# Altium schematic sheet ESP_Grow_Main_Rev_B_1_CPU.SchDoc
size A
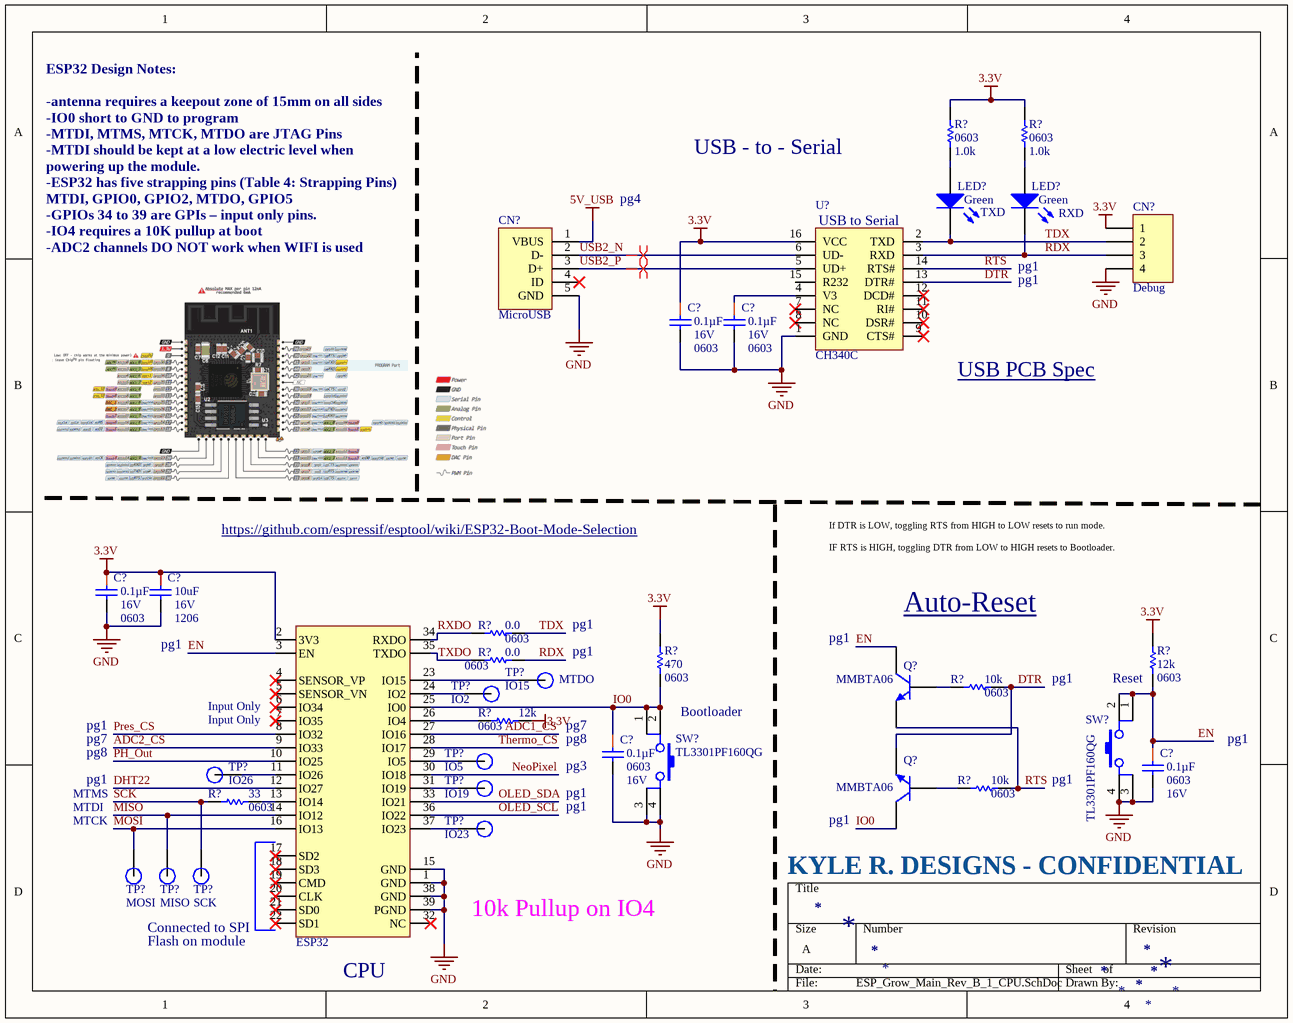
[diagram p0: ESP_Grow_Main_Rev_B_1_CPU.SchDoc]

## Parts
(Parts that share a designator on the sheet are numbered #1, #2 ... from top to bottom, then left to right.)
C?#1  Capacitance: 0.1µF  Package / Case: 0603  Voltage - Rated: 16V  [CAPC0603(1608)_L]  (hidden comment: 0.1uF)
C?#2  Capacitance: 0.1µF  Package / Case: 0603  Voltage - Rated: 16V  [CAPC0603(1608)_L]  (hidden comment: 0.1uF)
C?#3  Capacitance: 0.1µF  Package / Case: 0603  Voltage - Rated: 16V  [CAPC0603(1608)_L]  (hidden comment: 0.1uF)
C?#4  10uF  Voltage - Rated: 16V  Package: 1206  [CAPC1206(3216)_M]
C?#5  Capacitance: 0.1µF  Package / Case: 0603  Voltage - Rated: 16V  [CAPC0603(1608)_L]  (hidden comment: 0.1uF)
C?#6  Capacitance: 0.1µF  Package / Case: 0603  Voltage - Rated: 16V  [CAPC0603(1608)_L]  (hidden comment: 0.1uF)
CN?#1  Debug  [HDR1X4]
CN?#2  MicroUSB  [10118194-0001LF]
LED?#1  TXD  Color: Green  [SM-LED-0603]
LED?#2  RXD  Color: Green  [SM-LED-0603]
Q?#1  MMBTA06  [SOT23]
Q?#2  MMBTA06  [SOT23]
R?#1  Package / Case: 0603  [RESC0603(1608)_N]  (hidden comment: 1.0K)
R?#2  Package / Case: 0603  [RESC0603(1608)_N]  (hidden comment: 1.0K)
R?#3  Resistance (Ohms): 0.0  Package / Case: 0603  [RESC0603(1608)_N]  (hidden comment: 0)
R?#4  Resistance (Ohms): 0.0  Package / Case: 0603  [RESC0603(1608)_N]  (hidden comment: 0)
R?#5  Package / Case: 0603  [RESC0603(1608)_N]  (hidden comment: 470)
R?#6  Package / Case: 0603  [RESC0603(1608)_N]  (hidden comment: 12K)
R?#7  Resistance (Ohms): 10k  Package / Case: 0603  [RESC0603(1608)_L]  (hidden comment: 10K 1%)
R?#8  Package / Case: 0603  [RESC0603(1608)_N]  (hidden comment: 12K)
R?#9  Resistance (Ohms): 10k  Package / Case: 0603  [RESC0603(1608)_L]  (hidden comment: 10K 1%)
R?#10  Package / Case: 0603  [RESC0603(1608)_L]  (hidden comment: 33)
SW?#1  TL3301PF160QG  [TL3301PF160QG]
SW?#2  TL3301PF160QG  [TL3301PF160QG]
TP?#1  IO15  [TestPoint-Silk]  (no BOM)
TP?#2  IO2  [TestPoint-Silk]  (no BOM)
TP?#3  IO5  [TestPoint-Silk]  (no BOM)
TP?#4  IO26  [TestPoint-Silk]  (no BOM)
TP?#5  IO19  [TestPoint-Silk]  (no BOM)
TP?#6  IO23  [TestPoint-Silk]  (no BOM)
TP?#7  MOSI  [TestPoint-Silk]  (no BOM)
TP?#8  MISO  [TestPoint-Silk]  (no BOM)
TP?#9  SCK  [TestPoint-Silk]  (no BOM)
U?#1  CH340C  [SOP-16]
U?#2  ESP32  [ESP32]

## Nets
3.3V: C?#1.1 C?#3.1 C?#4.1 CN?#1.1 R?#1.2 R?#2.2 R?#5.2 R?#6.2 R?#8.1 U?#1.16(VCC) U?#2.2(3V3)
5V_USB: CN?#2.1(VBUS)
GND: C?#1.2 C?#2.2 C?#3.2 C?#4.2 C?#5.2 C?#6.2 CN?#1.4 CN?#2.5(GND) SW?#1.3 SW?#1.4 SW?#2.3 SW?#2.4 U?#1.1(GND) U?#2.1(GND) U?#2.15(GND) U?#2.38(GND) U?#2.39(PGND)
ADC1_CS: U?#2.27(IO16)
ADC2_CS: U?#2.9(IO33)
DHT22: U?#2.12(IO27)
DTR: Q?#2.2(E) R?#7.1 U?#1.13(DTR#)
EN: C?#6.1 Q?#1.3(C) R?#6.1 SW?#1.1 SW?#1.2 U?#2.3(EN)
IO0: C?#5.1 Q?#2.3(C) R?#5.1 SW?#2.1 SW?#2.2 U?#2.25(IO0)
MISO: TP?#8.1 U?#2.14(IO12)
MOSI: TP?#7.1 U?#2.16(IO13)
NeoPixel: U?#2.30(IO18)
OLED_SCL: U?#2.36(IO22)
OLED_SDA: U?#2.33(IO21)
PH_Out: U?#2.10(IO25)
Pres_CS: U?#2.8(IO32)
RDX: CN?#1.3 LED?#2.2 R?#4.1 U?#1.3(RXD)
RTS: Q?#1.2(E) R?#9.1 U?#1.14(RTS#)
RXDO: R?#3.2 U?#2.34(RXDO)
SCK: R?#10.2 TP?#9.1
TDX: CN?#1.2 LED?#1.2 R?#3.1 U?#1.2(TXD)
Thermo_CS: U?#2.28(IO17)
TXDO: R?#4.2 U?#2.35(TXDO)
USB2_N: CN?#2.2(D-) U?#1.6(UD-)
USB2_P: CN?#2.3(D+) U?#1.5(UD+)
NetC?#2_1: C?#2.1 U?#1.4(V3)
NetLED?#1_1: LED?#1.1 R?#1.1
NetLED?#2_1: LED?#2.1 R?#2.1
NetQ?#1_1: Q?#1.1(B) R?#7.2
NetQ?#2_1: Q?#2.1(B) R?#9.2
NetR?#8_2: R?#8.2 U?#2.26(IO4)
NetR?#10_1: R?#10.1 U?#2.13(IO14)
NetTP?#1_1: TP?#1.1 U?#2.23(IO15)
NetTP?#2_1: TP?#2.1 U?#2.24(IO2)
NetTP?#3_1: TP?#3.1 U?#2.29(IO5)
NetTP?#4_1: TP?#4.1 U?#2.11(IO26)
NetTP?#5_1: TP?#5.1 U?#2.31(IO19)
NetTP?#6_1: TP?#6.1 U?#2.37(IO23)

Not connected (* = marked no-connect by the designer): CN?#2 4(ID)*; U?#1 7(NC)* 8(NC)* 9(CTS#)* 10(DSR#)* 11(RI#)* 12(DCD#)* 15(R232); U?#2 4(SENSOR_VP)* 5(SENSOR_VN)* 6(IO34)* 7(IO35)* 17(SD2)* 18(SD3)* 19(CMD)* 20(CLK)* 21(SD0)* 22(SD1)* 32(NC)*

## Layout directives
differential pair: USB2_N, USB2_P

## Notes on the sheet
- USB - to - Serial
- pg4
- pg1
- (near LED?#2) pg1
- USB PCB Spec <https://www.ftdichip.com/Support/Documents/AppNotes/AN_146_USB_Hardware_Design_Guidelines_for_FTDI_ICs.pdf>
- ESP32 Design Notes:
  -antenna requires a keepout zone of 15mm on all sides
  -IO0 short to GND to program
  -MTDI, MTMS, MTCK, MTDO are JTAG Pins
  -MTDI should be kept at a low electric level when powering up the module.
  -ESP32 has five strapping pins (Table 4: Strapping Pins) MTDI, GPIO0, GPIO2, MTDO, GPIO5
  -GPIOs 34 to 39 are GPIs – input only pins.
  -IO4 requires a 10K pullup at boot
  -ADC2 channels DO NOT work when WIFI is used
- https://github.com/espressif/esptool/wiki/ESP32-Boot-Mode-Selection
- If DTR is LOW, toggling RTS from HIGH to LOW resets to run mode.
  IF RTS is HIGH, toggling DTR from LOW to HIGH resets to Bootloader.
- Auto-Reset <https://cdn.sparkfun.com/assets/learn_tutorials/5/0/7/esp32-thing-schematic.pdf>
- (near C?#4) pg1
- (near TP?#1) MTDO
- (near TP?#1) pg1
- (near R?#6) Reset
- pg7
- pg8
- (near U?#2) Input Only
- (near C?#5) pg3
- (near C?#5) pg8
- Bootloader
- MTMS
- MTDI
- MTCK
- (near C?#5) pg1
- (near Q?#2) pg1
- KYLE R. DESIGNS - CONFIDENTIAL
- Flash on module
- Connected to SPI
- 10k Pullup on IO4
- (near U?#2) CPU
- (in symbol CH340C) USB to Serial

## Library data of the parts
C?#1-C?#3 C?#5 C?#6 = CAP CER 0.1UF 16V 10% X7R 0603: 0.1uF 0603 16V; Manufacturer: Kemet; Manufacturer Part Number: C0603C104K4RACTU; Tolerance: ±10%; Temperature Coefficient: X7R; Supplier 1: Digi-Key; RoHS: RoHS Compliant; Category: Capacitors; Stock 1: 2360000; Pricing 1: 4000=0.00414, 8000=0.00378, 12000=0.0036, 28000=0.00342, 100000=0.00248 (USD); Packaging: Tape & Reel (TR); Mounting Type: Surface Mount, MLCC; Operating Temperature: -55°C ~ 125°C; Applications: General Purpose; Ratings: -; Size / Dimension: 0.063" L x 0.031" W (1.60mm x 0.80mm); Height - Seated (Max): -; Thickness (Max): 0.034" (0.87mm); Lead Spacing: -; Features: -; Lead Style: -; ComponentLink1URL: http://www.kemet.com/datasheets&C0603C104K4RACTU; ComponentLink1Description: http://www.kemet.com/datasheets&C0603C104K4RACTU; Supplier Part Number 1: 399-1096-2-ND
C?#4 = CAP CER 10UF 16V 1206: Temperature Coefficient: X7R; LCSC: C126600; Capacitance: 10uF; Supplier 1: Digi-Key; Supplier Part Number 1: 490-4793-1-ND
CN?#1 = Header 4: Header, 4-Pin; Manufacturer: Sullins Connector Solutions; Manufacturer Part Number: PRPC004SAAN-RC; Connector Type: Header, Unshrouded, Breakaway; Number of Positions: 4; Number of Positions Loaded: All; Pitch: 0.100" (2.54mm); Supplier 1: Digi-Key; RoHS: RoHS Compliant; Category: Connectors, Interconnects; Stock 1: 0; Pricing 1: 1=0.2, 10=0.175, 100=0.1443, 500=0.1141, 1000=0.09794, 5000=0.08935, 10000=0.08591 (USD); Packaging: Bulk; Contact Type: Male Pin; Number of Rows: 1; Row Spacing: -; Contact Mating Length: 0.230" (5.84mm); Mounting Type: Through Hole; Termination: Solder; Fastening Type: -; Features: -; Contact Finish: Gold; Contact Finish Thickness: Flash; Color: Black; ComponentLink1URL: http://media.digikey.com/PDF/Data%20Sheets/Sullins%20PDFs/xRxCzzzSxxN-RC_ST_11635-B.pdf; ComponentLink1Description: http://media.digikey.com/PDF/Data%20Sheets/Sullins%20PDFs/xRxCzzzSxxN-RC_ST_11635-B.pdf; Supplier Part Number 1: S1011EC-04-ND
CN?#2 = 10118194-0001LF: Amphenol FCI CONN USB MICRO B RECPT SMT R/A; Connector Type: USB - micro B; Number of Contacts: 5; Gender: Receptacle; Specifications: USB 2.0; Number of Ports: 1; Current Rating: 1.8A per Contact; Voltage - Rated: 100VAC; Mating Cycles: 10000; Shielding: Shielded; Material Flammability Rating: UL94 V-0; ClassName: *; Supplier 1: Digi-Key; Manufacturer: Amphenol FCI; Manufacturer Part Number: 10118194-0001LF; RoHS: RoHS Compliant; Category: Connectors, Interconnects; Stock 1: 220681; Pricing 1: 1=0.46, 10=0.437, 25=0.3744, 50=0.318, 100=0.3056, 250=0.27444, 500=0.26196 (USD); Packaging: Cut Tape (CT); Part Status: Active; Mounting Type: Surface Mount, Right Angle; Through Hole; Mounting Feature: Horizontal; Termination: Solder; Features: Solder Retention; Ingress Protection: -; Operating Temperature: -30°C ~ 80°C; Contact Finish: Gold; Shell/Shielding Material: Steel, Stainless; Insulation Color: Black; ComponentLink1URL: http://portal.fciconnect.com/Comergent//fci/drawing/10118194.pdf; ComponentLink1Description: http://portal.fciconnect.com/Comergent//fci/drawing/10118194.pdf; Supplier Part Number 1: 609-4618-1-ND
LED?#1 LED?#2 = LTST-C191KGKT: LED GREEN CLEAR THIN 0603 SMD; Manufacturer: Lite-On Inc; Wavelength - Dominant: 571nm; Wavelength - Peak: 574nm; Millicandela Rating: 35mcd; Voltage - Forward (Vf) (Typ): 2V; Current - Test: 20mA; Viewing Angle: 130°; Lens Style/Size: Rectangle with Flat Top, 1.1mm x 0.8mm; Supplier 1: Digi-Key; Manufacturer Part Number: LTST-C191KGKT; RoHS: RoHS Compliant; Category: Optoelectronics; Stock 1: 84829; Pricing 1: 1=0.3, 10=0.238, 100=0.1296, 250=0.0864, 500=0.07344, 1000=0.05616, 2500=0.05076 (USD); Packaging: Cut Tape (CT); Lens Type: Clear; Package / Case: 0603 (1608 Metric); Size / Dimension: 1.60mm L x 0.80mm W; Height: 0.55mm; Mounting Type: Surface Mount; Luminous Flux @ Current - Test: -; ComponentLink1URL: http://optoelectronics.liteon.com/upload/download/DS22-2000-228/S_110_LTST-C191KGKT.pdf; ComponentLink1Description: http://optoelectronics.liteon.com/upload/download/DS22-2000-228/S_110_LTST-C191KGKT.pdf; Supplier Part Number 1: 160-1446-1-ND; ClassName: *
Q?#1 Q?#2 = MMBTA06: TRANS NPN 80V 0.5A SOT-23; Manufacturer: ON Semiconductor; Manufacturer Part Number: MMBTA06LT3G; Vce Saturation (Max) @ Ib, Ic: 250mV @ 10mA, 100mA; Current - Collector Cutoff (Max): 100nA; DC Current Gain (hFE) (Min) @ Ic, Vce: 100 @ 100mA, 1V; Frequency - Transition: 100MHz; Supplier 1: Digi-Key; RoHS: RoHS Compliant; Category: Discrete Semiconductor Products; Stock 1: 16604; Pricing 1: 1=0.21, 10=0.196, 100=0.1067, 500=0.06566, 1000=0.04476 (USD); Packaging: Cut Tape (CT); Part Status: Active; Transistor Type: NPN; Operating Temperature: -55°C ~ 150°C (TJ); Mounting Type: Surface Mount; Package / Case: TO-236-3, SC-59, SOT-23-3; Supplier Device Package: SOT-23-3 (TO-236); Base Part Number: MMBTA06; ComponentLink1URL: http://www.onsemi.com/pub/Collateral/MMBTA05LT1-D.PDF; ComponentLink1Description: http://www.onsemi.com/pub/Collateral/MMBTA05LT1-D.PDF; Supplier Part Number 1: MMBTA06LT3GOSCT-ND
R?#1 R?#2 = RES 1K OHM 1% 1/10W 0603: 1.0K 0603; Manufacturer: Stackpole Electronics Inc.; Manufacturer Part Number: RMCF0603FT1K00; Tolerance: ±1%; Power (Watts): 0.1W, 1/10W; Temperature Coefficient: ±100ppm/°C; Supplier 1: Digi-Key; RoHS: RoHS Compliant; Category: Resistors; Stock 1: 411308; Pricing 1: 1=0.1, 10=0.02, 100=0.0081, 1000=0.00364, 2500=0.00316 (USD); Packaging: Cut Tape (CT); Part Status: Active; Composition: Thick Film; Features: Automotive AEC-Q200; Operating Temperature: -55°C ~ 155°C; Size / Dimension: 0.061" L x 0.031" W (1.55mm x 0.80mm); Height - Seated (Max): 0.022" (0.55mm); Failure Rate: -; ComponentLink1URL: https://www.seielect.com/Catalog/SEI-RMCF_RMCP.pdf; ComponentLink1Description: https://www.seielect.com/Catalog/SEI-RMCF_RMCP.pdf; Supplier Part Number 1: RMCF0603FT1K00CT-ND; Supplier Device Package: 0603; Resistance (Ohms): 1.0k
R?#3 R?#4 = RES 0.0 OHM 1/10W JUMP 0603 SMD: 0 0603; Manufacturer: Panasonic Electronic Components; Manufacturer Part Number: ERJ-3GEY0R00V; Tolerance: Jumper; Power (Watts): 0.1W, 1/10W; Supplier 1: Digi-Key; RoHS: RoHS Compliant; Category: Resistors; Stock 1: 4812214; Pricing 1: 1=0.1, 50=0.0126, 100=0.0096, 250=0.00716, 500=0.00528, 1000=0.00352, 2500=0.00297 (USD); Packaging: Cut Tape (CT); Composition: Thick Film; Features: -; Temperature Coefficient: -; Supplier Device Package: 0603; Size / Dimension: 0.063" L x 0.031" W (1.60mm x 0.80mm); Height: 0.022" (0.55mm); Number of Terminations: 2; ComponentLink1URL: http://industrial.panasonic.com/www-cgi/jvcr13pz.cgi?E+PZ+3+AOA0001+ERJ3GEY0R00V+7+WW; ComponentLink1Description: http://industrial.panasonic.com/www-cgi/jvcr13pz.cgi?E+PZ+3+AOA0001+ERJ3GEY0R00V+7+WW; Supplier Part Number 1: P0.0GCT-ND
R?#5 = RES 470 OHM 1/10W 1% 0603 SMD: 470 0603; Manufacturer: Yageo; Manufacturer Part Number: RC0603FR-07470RL; Tolerance: ±1%; Power (Watts): 0.1W, 1/10W; Temperature Coefficient: ±100ppm/°C; Supplier 1: Digi-Key; RoHS: RoHS Compliant; Category: Resistors; Stock 1: 184849; Pricing 1: 1=0.1, 10=0.015, 25=0.0108, 100=0.006, 250=0.00456, 500=0.00364, 1000=0.00268, 2500=0.00233 (USD); Packaging: Cut Tape (CT); Resistance (Ohms): 470; Composition: Thick Film; Features: -; Supplier Device Package: 0603; Size / Dimension: 0.063" L x 0.031" W (1.60mm x 0.80mm); Height: 0.022" (0.55mm); Number of Terminations: 2; ComponentLink1URL: http://www.yageo.com/documents/recent/PYu-RC0603_51_RoHS_L_4.pdf; ComponentLink1Description: http://www.yageo.com/documents/recent/PYu-RC0603_51_RoHS_L_4.pdf; Supplier Part Number 1: 311-470HRCT-ND
R?#6 R?#8 = RES 12K OHM 1/10W 1% 0603 SMD: 12K 1% 0603; Manufacturer: Rohm Semiconductor; Manufacturer Part Number: MCR03ERTF1202; Power (Watts): 0.1W, 1/10W; Temperature Coefficient: ±100ppm/°C; Supplier 1: Digi-Key; RoHS: RoHS Compliant; Category: Resistors; Stock 1: 128338; Pricing 1: 1=0.1, 10=0.011, 25=0.0084, 100=0.0047, 250=0.00356, 500=0.00286, 1000=0.0021 (USD); Packaging: Cut Tape (CT); Tolerance: ±1%; Composition: Thick Film; Features: -; Operating Temperature: -55°C ~ 155°C; Supplier Device Package: 0603 (1608 Metric); Size / Dimension: 0.063" L x 0.031" W (1.60mm x 0.80mm); Height: 0.022" (0.55mm); Number of Terminations: 2; ComponentLink1URL: http://rohmfs.rohm.com/en/products/databook/datasheet/passive/resistor/chip_resistor/mcr_g.pdf; ComponentLink1Description: http://rohmfs.rohm.com/en/products/databook/datasheet/passive/resistor/chip_resistor/mcr_g.pdf; Supplier Part Number 1: RHM12.0KCLCT-ND; Resistance (Ohms): 12k
R?#7 R?#9 = RES 10K OHM 1/10W 1% 0603 SMD: 10K 0603; Manufacturer: Panasonic Electronic Components; Manufacturer Part Number: ERJ-3EKF1002V; Power (Watts): 0.1W, 1/10W; Temperature Coefficient: ±100ppm/°C; Category: Resistors; Supplier 1: Digi-Key; RoHS: RoHS Compliant; Stock 1: 5046430; Pricing 1: 1=0.1, 50=0.015, 100=0.0114, 250=0.00844, 500=0.00624, 1000=0.00416, 2500=0.00351 (USD); Packaging: Cut Tape (CT); Tolerance: ±1%; Composition: Thick Film; Features: -; Supplier Device Package: 0603; Size / Dimension: 0.063" L x 0.031" W (1.60mm x 0.80mm); Height: 0.022" (0.55mm); Number of Terminations: 2; ComponentLink1URL: http://industrial.panasonic.com/www-cgi/jvcr13pz.cgi?E+PZ+3+AOA0002+ERJ3EKF1002V+7+WW; ComponentLink1Description: http://industrial.panasonic.com/www-cgi/jvcr13pz.cgi?E+PZ+3+AOA0002+ERJ3EKF1002V+7+WW; Supplier Part Number 1: P10.0KHCT-ND
R?#10 = RES 33 OHM 1/10W 5% 0603 SMD: 33 0603; Manufacturer: Panasonic Electronic Components; Manufacturer Part Number: ERJ-3GEYJ330V; Tolerance: ±5%; Power (Watts): 0.1W, 1/10W; Temperature Coefficient: ±200ppm/°C; Supplier 1: Digi-Key; RoHS: RoHS Compliant; Category: Resistors; Stock 1: 499360; Pricing 1: 1=0.1, 50=0.0126, 100=0.0096, 250=0.00716, 500=0.00528, 1000=0.00352, 2500=0.00297 (USD); Packaging: Cut Tape (CT); Resistance (Ohms): 33; Composition: Thick Film; Features: -; Supplier Device Package: 0603; Size / Dimension: 0.063" L x 0.031" W (1.60mm x 0.80mm); Height: 0.022" (0.55mm); Number of Terminations: 2; ComponentLink1URL: http://industrial.panasonic.com/www-cgi/jvcr13pz.cgi?E+PZ+3+AOA0001+ERJ3GEYJ330V+7+WW; ComponentLink1Description: http://industrial.panasonic.com/www-cgi/jvcr13pz.cgi?E+PZ+3+AOA0001+ERJ3GEYJ330V+7+WW; Supplier Part Number 1: P33GCT-ND
SW?#1 SW?#2 = TL3301PF160QG: SWITCH TACTILE SPST-NO 0.05A 12V; Manufacturer: E-Switch; Switch Function: Off-Mom; Contact Rating @ Voltage: 0.05A @ 12VDC; Actuator Type: Standard; Actuator Height off PCB, Vertical: 8.50mm; Actuator Orientation: Top Actuated; Outline: 6.00mm x 6.00mm; Illumination: Non-Illuminated; Operating Force: 160gf; Actuator Material: Polyamide (PA), Nylon; Switch Travel: 0.25mm; Mechanical Life: 100,000 Cycles; ClassName: *; Supplier 1: Digi-Key; Manufacturer Part Number: TL3301PF160QG; RoHS: RoHS Compliant; Category: Switches; Stock 1: 25527; Pricing 1: 1=0.38, 10=0.37, 25=0.3564, 50=0.3432, 100=0.33, 250=0.3036 (USD); Packaging: Cut Tape (CT); Part Status: Active; Circuit: SPST-NO; Mounting Type: Surface Mount; Actuator Length, Right Angle: -; Termination Style: Gull Wing; Illumination Type, Color: -; Illumination Voltage (Nominal): -; Ingress Protection: -; Features: -; Operating Temperature: -20°C ~ 70°C; ComponentLink1URL: https://www.e-switch.com/system/asset/product_line/data_sheet/158/TL3301.pdf; ComponentLink1Description: https://www.e-switch.com/system/asset/product_line/data_sheet/158/TL3301.pdf; Supplier Part Number 1: EG4562CT-ND
TP?#1-TP?#9 = TestPoint - Current: Test Point
U?#1 = CH340C: USB to Serial UART; ComponentLink2URL: https://lcsc.com/product-detail/USB_CH340C_C84681.html; ComponentLink1URL: https://www.sparkfun.com/products/15096; ComponentLink2Description: LCSC Part Link; ComponentLink1Description: Sparkfun Demo Board
U?#2 = U/ESP32-WROOM-32D: ESP32 module